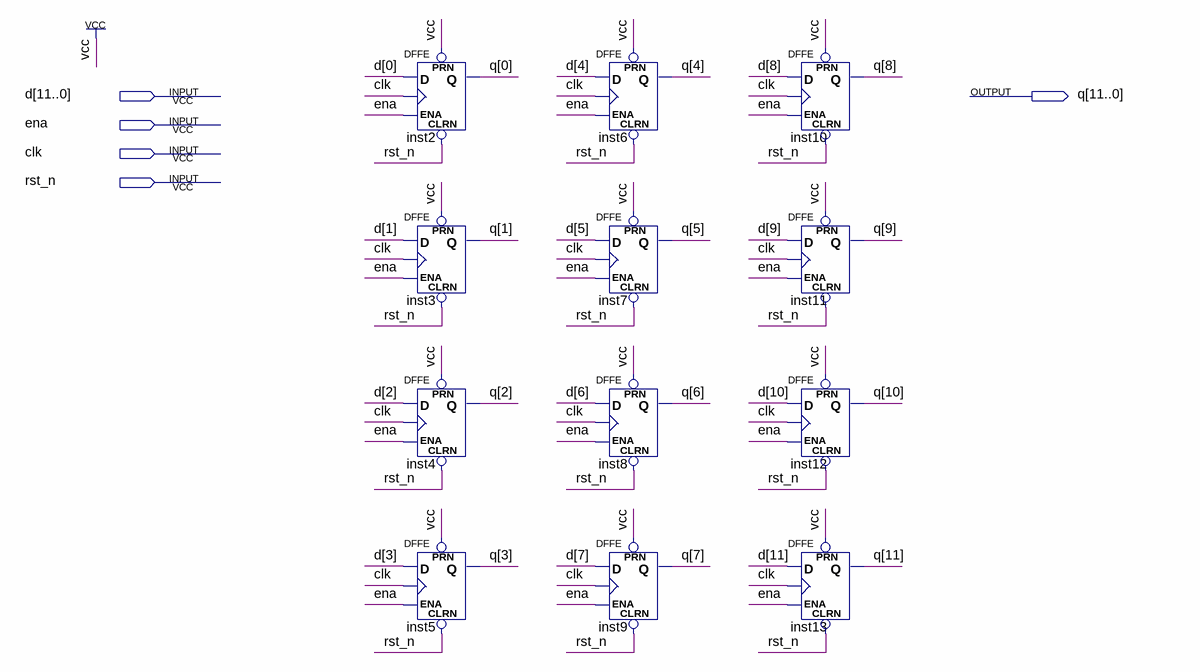
[diagram p0: schematic sheet]
// Quartus schematic reg12.bdf as structural Verilog: 12 symbols, 5 pins
module reg12 (
  input  [11:0] d,
  input  ena,
  input  clk,
  input  rst_n,
  output [11:0] q
);

  DFFE inst2 (.PRN(1'b1), .CLRN(rst_n), .D(d[0]), .CLK(clk), .ENA(ena), .Q(q[0]));
  DFFE inst3 (.PRN(1'b1), .CLRN(rst_n), .D(d[1]), .CLK(clk), .ENA(ena), .Q(q[1]));
  DFFE inst4 (.PRN(1'b1), .CLRN(rst_n), .D(d[2]), .CLK(clk), .ENA(ena), .Q(q[2]));
  DFFE inst5 (.PRN(1'b1), .CLRN(rst_n), .D(d[3]), .CLK(clk), .ENA(ena), .Q(q[3]));
  DFFE inst6 (.PRN(1'b1), .CLRN(rst_n), .D(d[4]), .CLK(clk), .ENA(ena), .Q(q[4]));
  DFFE inst7 (.PRN(1'b1), .CLRN(rst_n), .D(d[5]), .CLK(clk), .ENA(ena), .Q(q[5]));
  DFFE inst8 (.PRN(1'b1), .CLRN(rst_n), .D(d[6]), .CLK(clk), .ENA(ena), .Q(q[6]));
  DFFE inst9 (.PRN(1'b1), .CLRN(rst_n), .D(d[7]), .CLK(clk), .ENA(ena), .Q(q[7]));
  DFFE inst10 (.PRN(1'b1), .CLRN(rst_n), .D(d[8]), .CLK(clk), .ENA(ena), .Q(q[8]));
  DFFE inst11 (.PRN(1'b1), .CLRN(rst_n), .D(d[9]), .CLK(clk), .ENA(ena), .Q(q[9]));
  DFFE inst12 (.PRN(1'b1), .CLRN(rst_n), .D(d[10]), .CLK(clk), .ENA(ena), .Q(q[10]));
  DFFE inst13 (.PRN(1'b1), .CLRN(rst_n), .D(d[11]), .CLK(clk), .ENA(ena), .Q(q[11]));
endmodule
